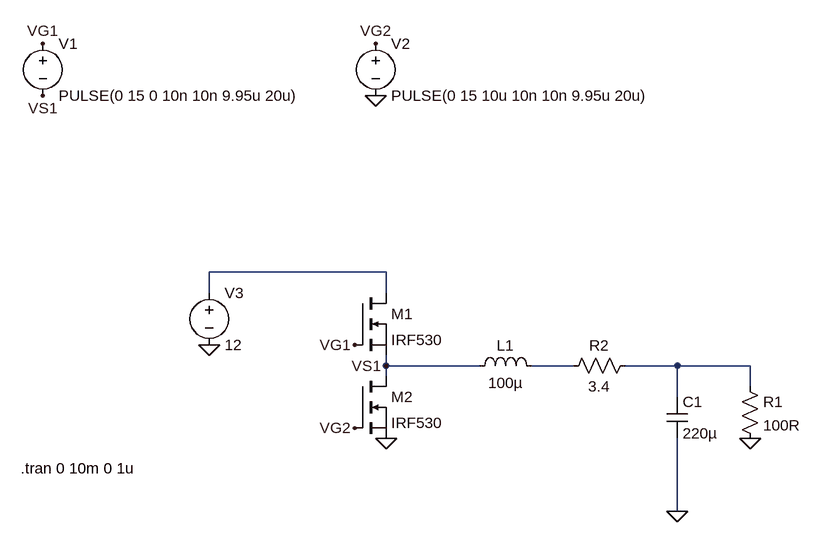
[diagram p0: schematic lt_spice_buck.asc]
lt_spice_buck.asc, the LTspice schematic file:
Version 4
SHEET 1 880 680
WIRE 208 64 -64 64
WIRE -64 96 -64 64
WIRE 208 96 208 64
WIRE 208 208 208 192
WIRE 352 208 208 208
WIRE 496 208 432 208
WIRE 656 208 576 208
WIRE 768 208 656 208
WIRE 208 224 208 208
WIRE 768 240 768 208
WIRE 656 256 656 208
WIRE 656 432 656 320
FLAG -320 -288 VG1
FLAG -320 -208 VS1
FLAG 192 -208 0
FLAG 208 320 0
FLAG 192 -288 VG2
FLAG 160 176 VG1
FLAG 160 304 VG2
FLAG 208 208 VS1
FLAG -64 176 0
FLAG 656 432 0
FLAG 768 320 0
SYMBOL nmos 160 96 R0
SYMATTR InstName M1
SYMATTR Value IRF530
SYMBOL nmos 160 224 R0
SYMATTR InstName M2
SYMATTR Value IRF530
SYMBOL voltage -320 -304 R0
WINDOW 123 0 0 Left 0
WINDOW 39 0 0 Left 0
SYMATTR InstName V1
SYMATTR Value PULSE(0 15 0 10n 10n 9.95u 20u)
SYMBOL voltage 192 -304 R0
WINDOW 123 0 0 Left 0
WINDOW 39 0 0 Left 0
SYMATTR InstName V2
SYMATTR Value PULSE(0 15 10u 10n 10n 9.95u 20u)
SYMBOL voltage -64 80 R0
WINDOW 123 0 0 Left 0
WINDOW 39 0 0 Left 0
SYMATTR InstName V3
SYMATTR Value 12
SYMBOL ind 336 224 R270
WINDOW 0 32 56 VTop 2
WINDOW 3 5 56 VBottom 2
SYMATTR InstName L1
SYMATTR Value 100µ
SYMBOL cap 640 256 R0
SYMATTR InstName C1
SYMATTR Value 220µ
SYMBOL res 752 224 R0
SYMATTR InstName R1
SYMATTR Value 100R
SYMBOL res 592 192 R90
WINDOW 0 0 56 VBottom 2
WINDOW 3 32 56 VTop 2
SYMATTR InstName R2
SYMATTR Value 3.4
TEXT -354 366 Left 2 !.tran 0 10m 0 1u

The netlist it stands for:
* lt_spice_buck.asc
M1 N001 VG1 VS1 VS1 IRF530
M2 VS1 VG2 0 0 IRF530
V1 VG1 VS1 PULSE(0 15 0 10n 10n 9.95u 20u)
V2 VG2 0 PULSE(0 15 10u 10n 10n 9.95u 20u)
V3 N001 0 12
L1 VS1 N002 100µ
C1 N003 0 220µ
R1 N003 0 100R
R2 N003 N002 3.4
.model NMOS NMOS
.model PMOS PMOS
.lib standard.mos
.tran 0 10m 0 1u
.backanno
.end